# EAGLE design S88_Nano_16R0C_2Layers_DuPont (EAGLE 9.6.2)
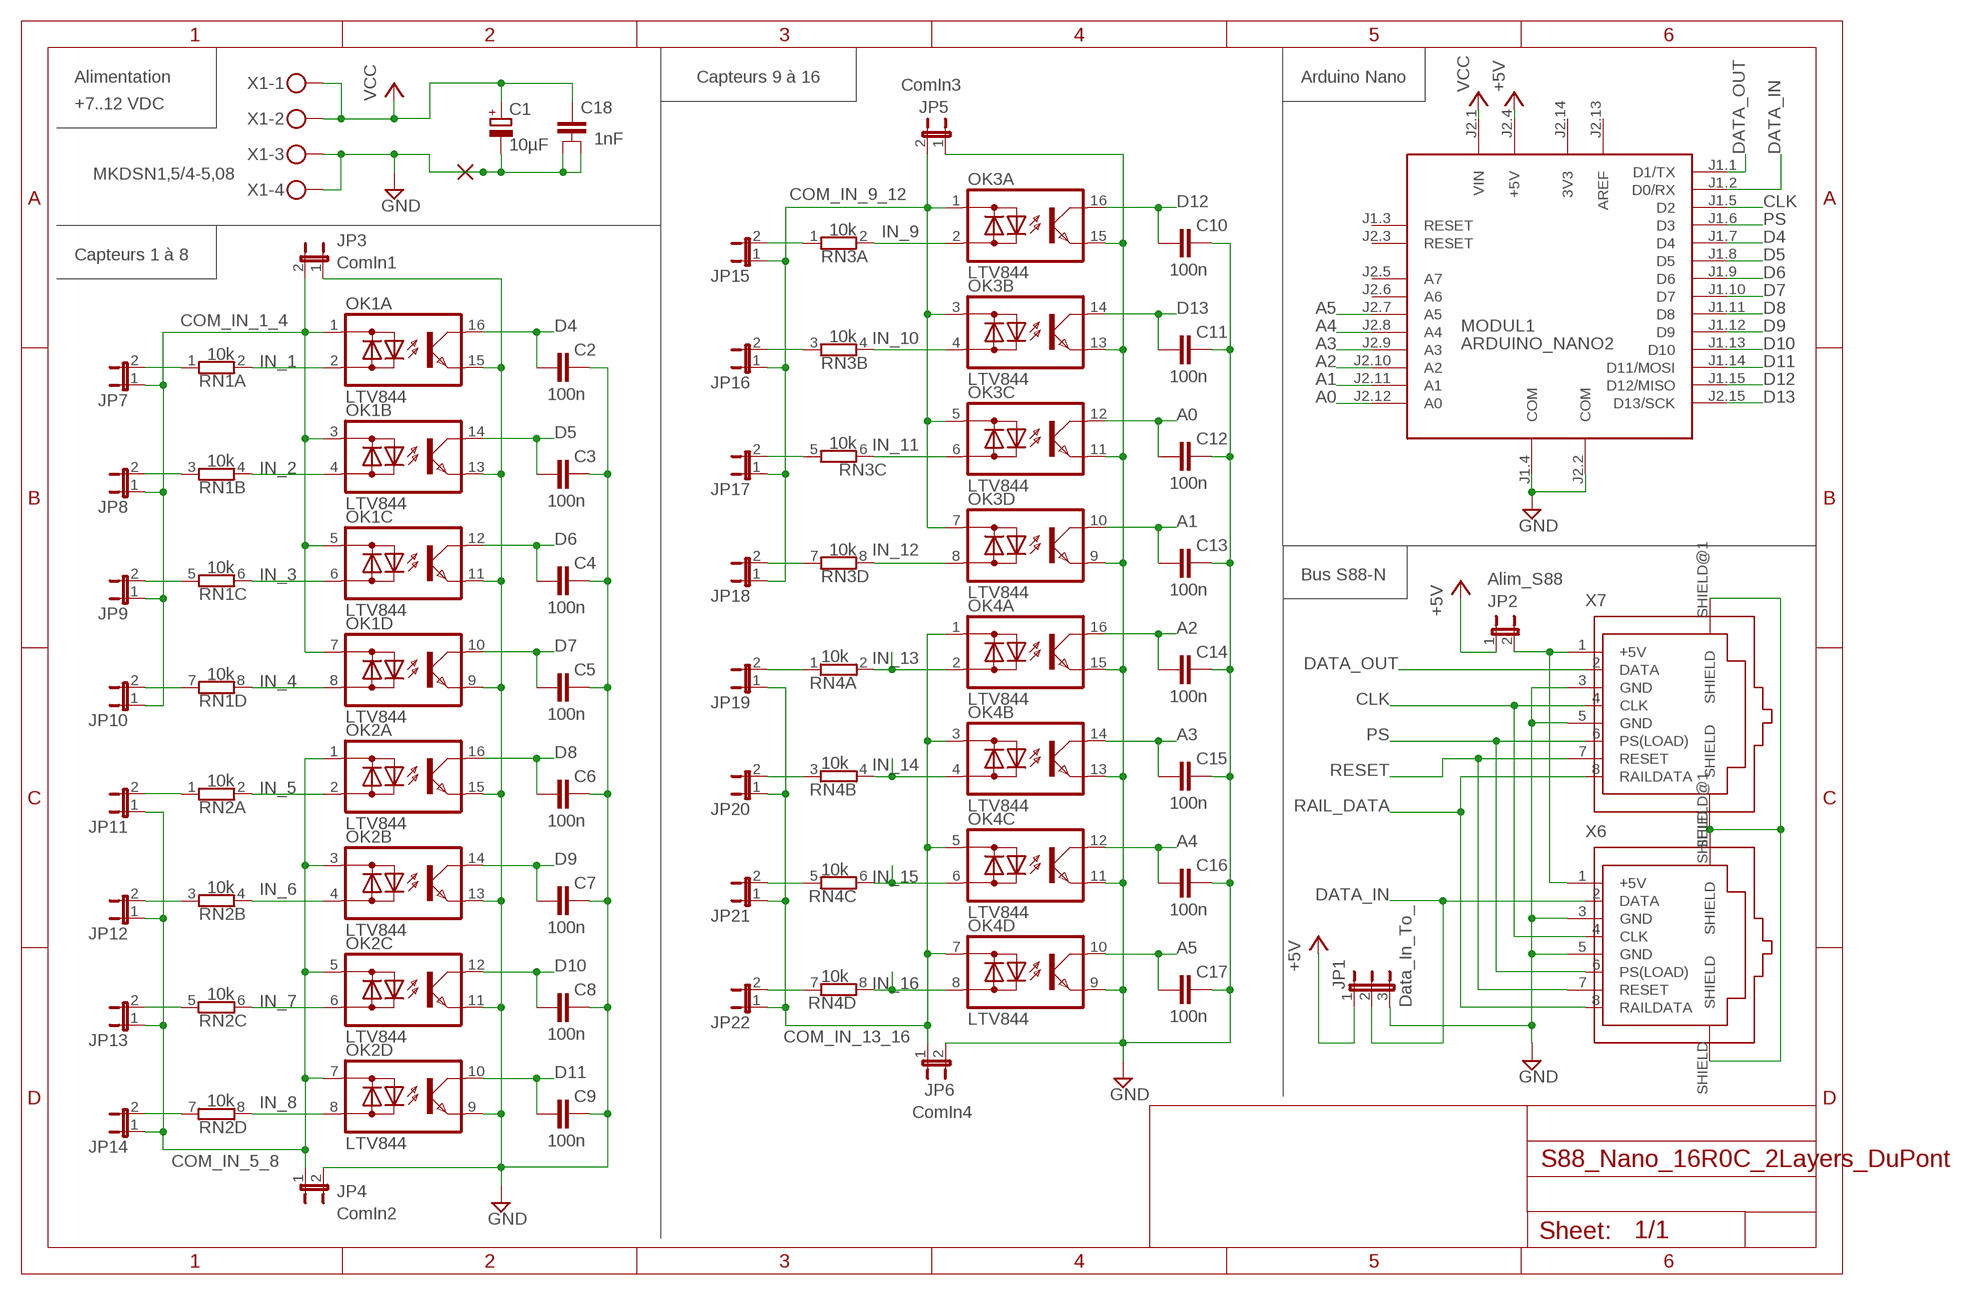
[diagram p0: schematic, sheet 1]

## Parts
C1  10µF  CPOL-EUE5-6  [E5-6]
C2  100n  C-EU025-025X050  [C025-025X050]
C3  100n  C-EU025-025X050  [C025-025X050]
C4  100n  C-EU025-025X050  [C025-025X050]
C5  100n  C-EU025-025X050  [C025-025X050]
C6  100n  C-EU025-025X050  [C025-025X050]
C7  100n  C-EU025-025X050  [C025-025X050]
C8  100n  C-EU025-025X050  [C025-025X050]
C9  100n  C-EU025-025X050  [C025-025X050]
C10  100n  C-EU025-025X050  [C025-025X050]
C11  100n  C-EU025-025X050  [C025-025X050]
C12  100n  C-EU025-025X050  [C025-025X050]
C13  100n  C-EU025-025X050  [C025-025X050]
C14  100n  C-EU025-025X050  [C025-025X050]
C15  100n  C-EU025-025X050  [C025-025X050]
C16  100n  C-EU025-025X050  [C025-025X050]
C17  100n  C-EU025-025X050  [C025-025X050]
C18  1nF  C-EU  [C025_050-024X070]
JP1  Data_In_To_  JP2E  [JP2]
JP2  Alim_S88  JP1E  [JP1]
JP3  ComIn1  JP1E  [JP1]
JP4  ComIn2  JP1E  [JP1]
JP5  ComIn3  JP1E  [JP1]
JP6  ComIn4  JP1E  [JP1]
JP7  JP1E  [JP1]
JP8  JP1E  [JP1]
JP9  JP1E  [JP1]
JP10  JP1E  [JP1]
JP11  JP1E  [JP1]
JP12  JP1E  [JP1]
JP13  JP1E  [JP1]
JP14  JP1E  [JP1]
JP15  JP1E  [JP1]
JP16  JP1E  [JP1]
JP17  JP1E  [JP1]
JP18  JP1E  [JP1]
JP19  JP1E  [JP1]
JP20  JP1E  [JP1]
JP21  JP1E  [JP1]
JP22  JP1E  [JP1]
MODUL1  ARDUINO_NANO2  [ARDUINO_NANO2]
OK1  LTV844  [DIL16]
OK2  LTV844  [DIL16]
OK3  LTV844  [DIL16]
OK4  LTV844  [DIL16]
PAD1  1,9/0,8  [1,6/0,9]
RN1  10k  E4R  [SIL8]
RN2  10k  E4R  [SIL8]
RN3  10k  E4R  [SIL8]
RN4  10k  E4R  [SIL8]
X1  MKDSN1,5/4-5,08  [MKDSN1,5/4-5,08]
X6  RJ45-SHIELDED  [RJ45-SHIELDED]
X7  RJ45-SHIELDED  [RJ45-SHIELDED]

## Nets
+5/S88: JP2.2 X6.1(+5V) X7.1(+5V)
+5V: JP1.1 JP2.1 MODUL1.J2.4(+5V)
A0: C12.1 MODUL1.J2.12(A0) OK3.12(C:C)
A1: C13.1 MODUL1.J2.11(A1) OK3.10(D:C)
A2: C14.1 MODUL1.J2.10(A2) OK4.16(A:C)
A3: C15.1 MODUL1.J2.9(A3) OK4.14(B:C)
A4: C16.1 MODUL1.J2.8(A4) OK4.12(C:C)
A5: C17.1 MODUL1.J2.7(A5) OK4.10(D:C)
CLK: MODUL1.J1.5(D2) X6.4(CLK) X7.4(CLK)
COM_IN_1_4: JP3.2 JP7.1 JP8.1 JP9.1 JP10.1 OK1.1(A:AC1) OK1.3(B:AC1) OK1.5(C:AC1) OK1.7(D:AC1)
COM_IN_5_8: JP4.1 JP11.1 JP12.1 JP13.1 JP14.1 OK2.1(A:AC1) OK2.3(B:AC1) OK2.5(C:AC1) OK2.7(D:AC1)
COM_IN_9_12: JP5.2 JP15.1 JP16.1 JP17.1 JP18.1 OK3.1(A:AC1) OK3.3(B:AC1) OK3.5(C:AC1) OK3.7(D:AC1)
COM_IN_13_16: JP6.1 JP19.1 JP20.1 JP21.1 JP22.1 OK4.1(A:AC1) OK4.3(B:AC1) OK4.5(C:AC1) OK4.7(D:AC1)
D4: C2.1 MODUL1.J1.7(D4) OK1.16(A:C)
D5: C3.1 MODUL1.J1.8(D5) OK1.14(B:C)
D6: C4.1 MODUL1.J1.9(D6) OK1.12(C:C)
D7: C5.1 MODUL1.J1.10(D7) OK1.10(D:C)
D8: C6.1 MODUL1.J1.11(D8) OK2.16(A:C)
D9: C7.1 MODUL1.J1.12(D9) OK2.14(B:C)
D10: C8.1 MODUL1.J1.13(D10) OK2.12(C:C)
D11: C9.1 MODUL1.J1.14(D11/MOSI) OK2.10(D:C)
D12: C10.1 MODUL1.J1.15(D12/MISO) OK3.16(A:C)
D13: C11.1 MODUL1.J2.15(D13/SCK) OK3.14(B:C)
DATA_IN: JP1.2 MODUL1.J1.2(D0/RX) X6.2(DATA)
DATA_OUT: MODUL1.J1.1(D1/TX) X7.2(DATA)
GND: C1.- C2.2 C3.2 C4.2 C5.2 C6.2 C7.2 C8.2 C9.2 C10.2 C11.2 C12.2 C13.2 C14.2 C15.2 C16.2 C17.2 C18.2 C18.3 JP1.3 JP3.1 JP4.2 JP5.1 JP6.2 MODUL1.J1.4(COM) MODUL1.J2.2(COM) OK1.9(D:E) OK1.11(C:E) OK1.13(B:E) OK1.15(A:E) OK2.9(D:E) OK2.11(C:E) OK2.13(B:E) OK2.15(A:E) OK3.9(D:E) OK3.11(C:E) OK3.13(B:E) OK3.15(A:E) OK4.9(D:E) OK4.11(C:E) OK4.13(B:E) OK4.15(A:E) PAD1.1(P) X1.3 X1.4 X6.3(GND) X6.5(GND) X7.3(GND) X7.5(GND)
IN_1: OK1.2(A:AC2) RN1.2
IN_2: OK1.4(B:AC2) RN1.4
IN_3: OK1.6(C:AC2) RN1.6
IN_4: OK1.8(D:AC2) RN1.8
IN_5: OK2.2(A:AC2) RN2.2
IN_6: OK2.4(B:AC2) RN2.4
IN_7: OK2.6(C:AC2) RN2.6
IN_8: OK2.8(D:AC2) RN2.8
IN_9: OK3.2(A:AC2) RN3.2
IN_10: OK3.4(B:AC2) RN3.4
IN_11: OK3.6(C:AC2) RN3.6
IN_12: OK3.8(D:AC2) RN3.8
IN_13: OK4.2(A:AC2) RN4.2
IN_14: OK4.4(B:AC2) RN4.4
IN_15: OK4.6(C:AC2) RN4.6
IN_16: OK4.8(D:AC2) RN4.8
N$1: JP7.2 RN1.1
N$2: JP8.2 RN1.3
N$3: JP9.2 RN1.5
N$4: JP10.2 RN1.7
N$5: JP11.2 RN2.1
N$6: JP19.2 RN4.1
N$7: JP14.2 RN2.7
N$8: JP13.2 RN2.5
N$9: JP18.2 RN3.7
N$10: JP20.2 RN4.3
N$11: JP12.2 RN2.3
N$12: JP21.2 RN4.5
N$13: JP22.2 RN4.7
N$14: JP15.2 RN3.1
N$15: JP16.2 RN3.3
N$16: JP17.2 RN3.5
PS: MODUL1.J1.6(D3) X6.6(PS(LOAD)) X7.6(PS(LOAD))
RAIL_DATA: X6.8(RAILDATA) X7.8(RAILDATA)
RESET: X6.7(RESET) X7.7(RESET)
SHIELD: X6.SHIELD X6.SHIELD@1(SHIELD) X7.SHIELD X7.SHIELD@1(SHIELD)
VCC: C1.+ C18.1 MODUL1.J2.1(VIN) X1.1 X1.2
Unconnected: MODUL1.J1.3(RESET) MODUL1.J2.3(RESET) MODUL1.J2.5(A7) MODUL1.J2.6(A6)

## Notes on the sheet
- Alimentation | Capteurs 9 à 16 | Arduino Nano
- +7..12 VDC
- Capteurs 1 à 8
- Bus S88-N

## Power pins joined to a net without a drawn wire
3V3: MODUL1.J2.14(3V3)
AREF: MODUL1.J2.13(AREF)

## Library data of the parts
C1 = rcl:CPOL-EU: POLARIZED CAPACITOR, European symbol
C2-C17 = rcl:C-EU: CAPACITOR, European symbol
C18 = rcl_perso:C-EU: CAPACITOR grid 2.54 mm + 5.08 mm, outline 2.4 x 7 mm
JP1 = jumper:JP2E: JUMPER
JP2-JP22 = jumper:JP1E: JUMPER
MODUL1 = arduino_Nano:ARDUINO_NANO2: Arduino Nano2 Auto generated by modulcreator.ulp \;; ANZAHL: 2; MODUL: TRUE; STECKX0: -76200; STECKX1: 76200; STECKY0: 177800; STECKY1: 177800
OK1-OK4 = optocoupler:LTV844: LITEON OPTO COUPLER
PAD1 = wirepad:1,9/0,8: THROUGH-HOLE PAD
RN1-RN4 = resistor-sil:E4R: SIL RESISTOR
X1 = con-phoenix-508:MKDSN1,5/4-5,08: MKDSN 1,5/ 4-5,08 Printklemme Nennstrom: 13,5 A Nennspannung: 250 V Rastermaß: 5,08 mm Polzahl: 4 Anschlussart: Schraubanschluss Montage: Löten Anschlussrichtung Leiter/Platine: 0 ° Artikelnummer: 1729144 Source: http://eshop.phoenixcontact.com .. 1729144.pdf
X6 X7 = con-amphenol-rj45_S88-N:RJ45-SHIELDED: RJ45 socket Naming: BEL FUSE SS-7188S-A-NF TME SS-7188S-A-NF Datasheet: https://www.belfuse.com/resources/drawings/stewartconnector/dr-stw-ss-7188s-a-nf-ss-7188s-a-nf-50.pdf

## Board
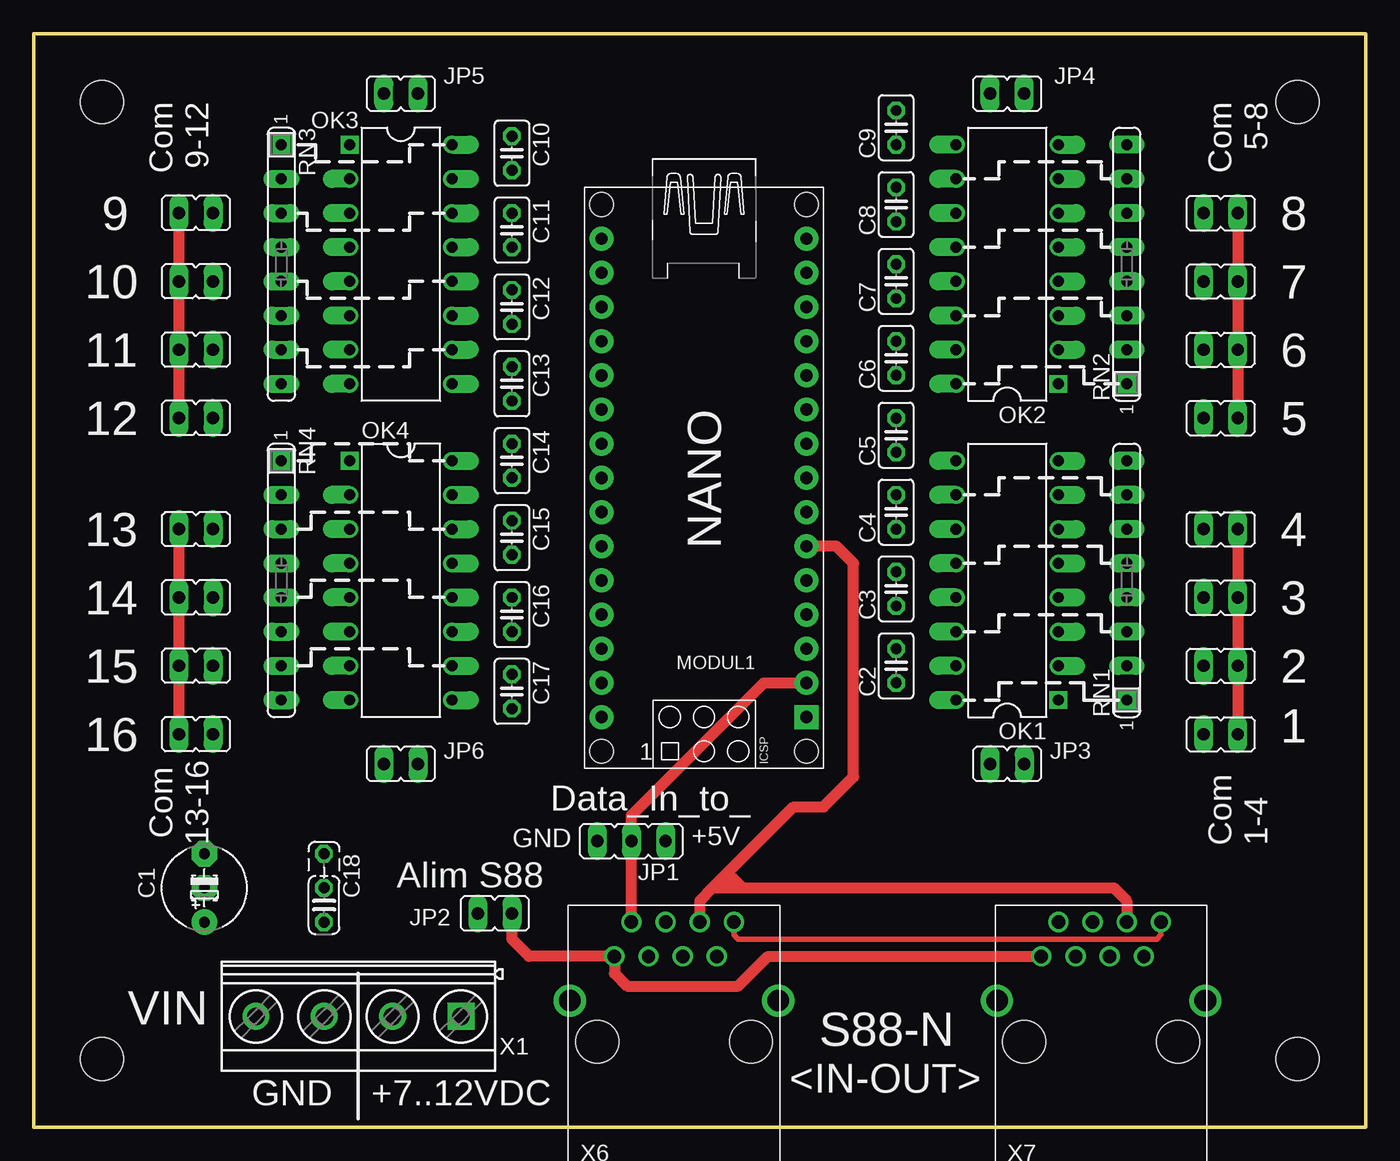
[diagram p1: board, top side]
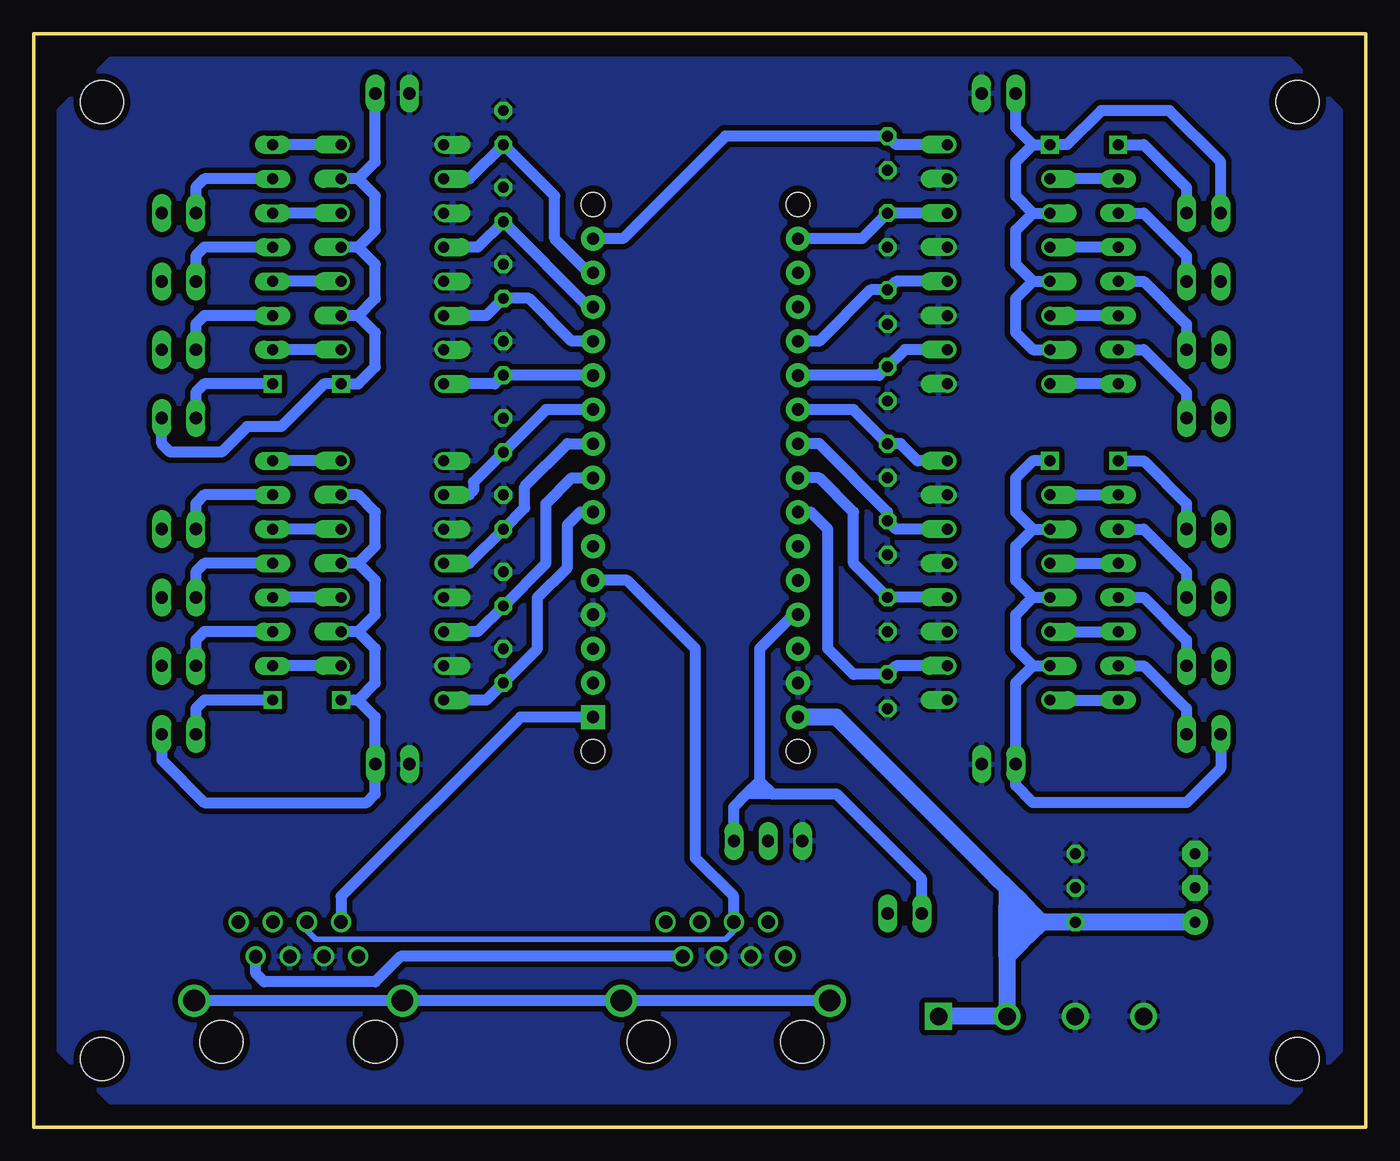
[diagram p2: board, bottom side, seen from below]

Size 99.06 x 81.28 mm. Coordinates in mm from the lower left corner, seen from the top.
Outline: 0,0 0,81.28 99.06,81.28 99.06,0 0,0
Copper layers (1*16): Top 0.035mm / dielectric 1.5mm / Bottom 0.035mm
Design rules "default *": minimum track width 10mil, minimum drill 24mil, track to track 8mil, track to pad 8mil, pad to pad 8mil, via to via 8mil, smd to smd 8mil, copper to edge 20mil, drill to drill 16mil, minimum pad ring 10mil, minimum via ring 8mil, stop-mask expansion 16mil, vias tented up to drill 0mil, thermal gap 10mil
Holes 3.2 mm at 93.98,5.08 5.08,5.08 5.08,76.2 93.98,76.2

### Footprints (pad centres in the part's own frame; a part is rotated, then mirrored left to right if it is on the bottom)
E5-6 = drill 0.813 pad 1.905: + -2.54,0 | drill 0.813 pad 1.905 octagon: - 2.54,0
C025-025X050 = drill 0.813 octagon: 1 -1.27,0; 2 1.27,0
C025_050-024X070 = drill 0.813 octagon: 1 2.54,0; 2 0,0; 3 -2.54,0
JP2 = drill 0.914 long: 1 -2.54,0; 2 0,0; 3 2.54,0
JP1 = drill 0.914 long: 1 0,-1.27; 2 0,1.27
ARDUINO_NANO2 = drill 0.914 pad 1.778 square: J1.1 -7.62,17.78 | drill 0.914 pad 1.778: J1.2 -7.62,15.24; J1.3 -7.62,12.7; J1.4 -7.62,10.16; J1.5 -7.62,7.62; J1.6 -7.62,5.08; J1.7 -7.62,2.54; J1.8 -7.62,0; J1.9 -7.62,-2.54; J1.10 -7.62,-5.08; J1.11 -7.62,-7.62; J1.12 -7.62,-10.16; J1.13 -7.62,-12.7; J1.14 -7.62,-15.24; J1.15 -7.62,-17.78; J2.1 7.62,17.78; J2.2 7.62,15.24; J2.3 7.62,12.7; J2.4 7.62,10.16; J2.5 7.62,7.62; J2.6 7.62,5.08; J2.7 7.62,2.54; J2.8 7.62,0; J2.9 7.62,-2.54; J2.10 7.62,-5.08; J2.11 7.62,-7.62; J2.12 7.62,-10.16; J2.13 7.62,-12.7; J2.14 7.62,-15.24; J2.15 7.62,-17.78 | hole 1.778: -7.62,-20.32; 7.62,-20.32; 7.62,20.32; -7.62,20.32
DIL16 = drill 0.813 square: 1 -8.89,-3.81 | drill 0.813 offset: 2 -6.35,-3.81; 3 -3.81,-3.81; 4 -1.27,-3.81; 5 1.27,-3.81; 6 3.81,-3.81; 7 6.35,-3.81; 8 8.89,-3.81; 9 8.89,3.81; 10 6.35,3.81; 11 3.81,3.81; 12 1.27,3.81; 13 -1.27,3.81; 14 -3.81,3.81; 15 -6.35,3.81; 16 -8.89,3.81
1,6/0,9 = drill 0.813 pad 1.905 octagon: 1 0,0
SIL8 = drill 0.813 square: 1 -8.89,0 | drill 0.813 long: 2 -6.35,0; 3 -3.81,0; 4 -1.27,0; 5 1.27,0; 6 3.81,0; 7 6.35,0; 8 8.89,0
MKDSN1,5/4-5,08 = drill 1.3 pad 2 square: 1 -7.641,0.025 | drill 1.3 pad 2: 2 -2.561,0.025; 3 2.519,0.025; 4 7.599,0.025
RJ45-SHIELDED = drill 1: 1 -5.08,7.62; 2 -3.81,10.16; 3 -2.54,7.62; 4 -1.27,10.16; 5 0,7.62; 6 1.27,10.16; 7 2.54,7.62; 8 3.81,10.16 | drill 1.6: SHIELD -8.382,4.318; SHIELD@1 7.112,4.318 | hole 3.2: -6.35,1.27; 5.08,1.27

### Placement (x,y rotation side)
C1  12.7,17.78 90 top
C2  64.14,34.29 90 top
C3  64.14,40.01 90 top
C4  64.14,45.72 90 top
C5  64.14,51.44 90 top
C6  64.14,57.15 90 top
C7  64.14,62.87 90 top
C8  64.14,68.58 90 top
C9  64.14,74.3 90 top
C10  35.56,72.39 270 top
C11  35.56,66.67 270 top
C12  35.56,60.96 270 top
C13  35.56,55.24 270 top
C14  35.56,49.53 270 top
C15  35.56,43.81 270 top
C16  35.56,38.1 270 top
C17  35.56,32.38 270 top
C18  21.59,17.78 270 top
JP1  44.45,21.27 180 top
JP2  34.29,15.88 270 top
JP3  72.39,26.99 270 top
JP4  72.39,76.83 90 top
JP5  27.3,76.83 90 top
JP6  27.3,26.99 270 top
JP7  88.27,29.21 90 top
JP8  88.27,34.29 90 top
JP9  88.27,39.37 90 top
JP10  88.27,44.45 90 top
JP11  88.27,52.7 90 top
JP12  88.27,57.78 90 top
JP13  88.27,62.87 90 top
JP14  88.27,67.94 90 top
JP15  12.06,67.94 270 top
JP16  12.06,62.87 270 top
JP17  12.06,57.78 270 top
JP18  12.06,52.7 270 top
JP19  12.06,44.45 270 top
JP20  12.06,39.37 270 top
JP21  12.06,34.29 270 top
JP22  12.06,29.21 270 top
MODUL1  49.85,48.26 180 top
OK1  72.39,40.64 90 top
OK2  72.39,64.14 90 top
OK3  27.3,64.14 270 top
OK4  27.3,40.64 270 top
PAD1  12.7,17.78 0 top
RN1  81.28,40.64 90 top
RN2  81.28,64.14 90 top
RN3  18.41,64.14 270 top
RN4  18.41,40.64 270 top
X1  24.13,8.26 180 top
X6  48.26,5.08 0 top
X7  80.01,5.08 0 top

### Tracks (layer width: path | path; a pad name or v marks a point on that pad's centre or on a via)
+5/S88
  Top 0.813: X7.1 54.61,12.7 52.39,10.48 44.13,10.48 43.18,11.43 X6.1 36.83,12.7 35.56,13.97 JP2.2
+5V
  Bottom 0.813: MODUL1.J2.4 42.55,38.1 45.09,35.56 45.09,25.72 | JP2.1 33.02,18.41 39.37,24.77 44.13,24.77 | 45.09,25.72 44.13,24.77 | 46.04,24.77 46.99,23.81 JP1.1 | 46.04,24.77 45.09,25.72 | 44.13,24.77 46.04,24.77
A0
  Bottom 0.813: MODUL1.J2.12 40.64,58.42 36.83,62.23 C12.1 34.92,62.87 OK3.12
A1
  Bottom 0.813: OK3.10 34.29,57.78 C13.1 36.2,55.88 MODUL1.J2.11
A2
  Bottom 0.813: MODUL1.J2.10 38.1,53.34 C14.1 34.61,50.8 33.34,49.53 OK4.16
A3
  Bottom 0.813: OK4.14 34.92,44.45 C15.1 35.56,45.72 40.64,50.8 MODUL1.J2.9
A4
  Bottom 0.813: OK4.12 C16.1 38.1,41.91 38.1,45.72 40.64,48.26 MODUL1.J2.8
A5
  Bottom 0.813: OK4.10 34.92,34.29 C17.1 38.1,33.66 40.01,35.56 40.01,44.45 41.27,45.72 MODUL1.J2.7
CLK
  Bottom 0.406: X7.4 78.74,14.61 78.11,13.97 47.62,13.97 46.99,14.61 X6.4
  Bottom 0.813: MODUL1.J1.5 54.93,40.64 49.85,35.56 49.85,20 46.99,17.14 X6.4
COM_IN_1_4
  Top 0.813: JP10.1 JP9.1 JP8.1 JP7.1
  Bottom 0.813: OK1.7 74.93,46.99 73.66,45.72 73.66,43.18 74.93,41.91 | 74.93,41.91 OK1.5 | 74.93,41.91 73.66,40.64 73.66,38.1 74.93,36.83 | 74.93,36.83 OK1.3 | 74.93,36.83 73.66,35.56 73.66,33.02 74.93,31.75 | 74.93,31.75 OK1.1 | 74.93,31.75 73.66,30.48 JP3.2 73.66,24.77 74.3,24.13 86.36,24.13 89.53,27.3 JP7.1
COM_IN_5_8
  Top 0.813: JP14.1 JP13.1 JP12.1 JP11.1
  Bottom 0.813: 74.93,60.33 73.66,59.05 73.66,56.52 74.93,55.24 OK2.1 77.47,55.24 80.64,52.07 83.19,52.07 85.09,50.16 88.9,50.16 89.53,50.8 JP11.1 | 74.93,60.33 OK2.3 | 74.93,60.33 73.66,61.59 73.66,64.14 74.93,65.41 | 74.93,65.41 OK2.5 | 74.93,65.41 73.66,66.67 73.66,69.22 74.93,70.48 | 74.93,70.48 OK2.7 | 74.93,70.48 73.66,71.75 JP4.1
COM_IN_9_12
  Top 0.813: JP15.1 JP16.1 JP17.1 JP18.1
  Bottom 0.813: 24.77,73.03 26.04,71.75 26.04,69.22 24.77,67.94 | 24.77,67.94 OK3.3 | 24.77,67.94 26.04,66.67 26.04,64.14 24.77,62.87 | 24.77,62.87 OK3.5 | 24.77,62.87 26.04,61.59 26.04,59.05 24.77,57.78 OK3.7 | 24.77,73.03 OK3.1 22.23,73.03 19.68,75.56 14.61,75.56 10.79,71.75 JP15.1 | 24.77,73.03 26.04,74.3 JP5.2
COM_IN_13_16
  Top 0.813: JP19.1 JP20.1 JP21.1 JP22.1
  Bottom 0.813: 24.77,44.45 26.04,45.72 26.04,48.26 24.77,49.53 OK4.1 | 24.77,44.45 OK4.3 | 24.77,44.45 26.04,43.18 26.04,40.64 24.77,39.37 | 24.77,39.37 OK4.5 | 24.77,39.37 26.04,38.1 26.04,35.56 24.77,34.29 | 24.77,34.29 OK4.7 | 24.77,34.29 26.04,33.02 JP6.1 26.04,25.4 24.77,24.13 13.34,24.13 10.79,26.67 JP22.1
D4
  Bottom 0.813: OK1.16 65.41,31.75 C2.1 61.59,35.56 61.59,39.37 59.37,41.59 59.37,44.77 58.42,45.72 MODUL1.J1.7
D5
  Bottom 0.813: OK1.14 66.04,36.83 C3.1 60.96,41.91 60.96,46.35 59.05,48.26 MODUL1.J1.8
D6
  Bottom 0.813: OK1.12 66.67,41.91 C4.1 62.55,46.04 62.55,47.62 59.37,50.8 MODUL1.J1.9
D7
  Bottom 0.813: OK1.10 66.67,46.99 66.36,47.31 66.36,47.94 C5.1 60.96,53.34 MODUL1.J1.10
D8
  Bottom 0.813: MODUL1.J1.11 C6.1 64.77,55.24 OK2.16
D9
  Bottom 0.813: MODUL1.J1.12 59.05,58.42 62.23,61.59 C7.1 65.41,60.33 OK2.14
D10
  Bottom 0.813: MODUL1.J1.13 57.78,60.96 C8.1 66.04,65.41 OK2.12
D11
  Bottom 0.813: MODUL1.J1.14 57.78,63.5 60.33,66.04 60.33,69.22 C9.1 66.67,70.48 OK2.10
D12
  Bottom 0.813: OK3.16 34.92,73.03 C10.1 47.62,73.66 55.24,66.04 MODUL1.J1.15
D13
  Bottom 0.813: OK3.14 C11.1 37.47,66.04 MODUL1.J2.15
DATA_IN
  Top 0.813: MODUL1.J1.2 54.29,33.02 44.45,23.18 JP1.2 X6.2
DATA_OUT
  Bottom 0.813: MODUL1.J1.1 62.87,30.48 76.2,17.14 X7.2
GND
  pour Bottom (isolate 0.406): 93.34,1.91 5.71,1.91 1.91,5.71 1.91,75.56 5.71,79.38 93.34,79.38 97.16,75.56 97.16,5.71
IN_1
  Bottom 0.813: OK1.2 RN1.2
IN_2
  Bottom 0.813: OK1.4 RN1.4
IN_3
  Bottom 0.813: OK1.6 RN1.6
IN_4
  Bottom 0.813: OK1.8 RN1.8
IN_5
  Bottom 0.813: OK2.2 RN2.2
IN_6
  Bottom 0.813: OK2.4 RN2.4
IN_7
  Bottom 0.813: OK2.6 RN2.6
IN_8
  Bottom 0.813: OK2.8 RN2.8
IN_9
  Bottom 0.813: RN3.2 OK3.2
IN_10
  Bottom 0.813: RN3.4 OK3.4
IN_11
  Bottom 0.813: RN3.6 OK3.6
IN_12
  Bottom 0.813: RN3.8 OK3.8
IN_13
  Bottom 0.813: OK4.2 RN4.2
IN_14
  Bottom 0.813: OK4.4 RN4.4
IN_15
  Bottom 0.813: OK4.6 RN4.6
IN_16
  Bottom 0.813: OK4.8 RN4.8
N$1
  Bottom 0.813: RN1.1 86.36,31.75 87,31.11 JP7.2
N$2
  Bottom 0.813: RN1.3 86.36,36.83 87,36.2 JP8.2
N$3
  Bottom 0.813: RN1.5 86.36,41.91 87,41.27 JP9.2
N$4
  Bottom 0.813: RN1.7 86.36,46.99 87,46.35 JP10.2
N$5
  Bottom 0.813: RN2.1 86.36,55.24 87,54.61 JP11.2
N$6
  Bottom 0.813: RN4.1 16.51,49.53 13.34,46.35 JP19.2
N$7
  Bottom 0.813: RN2.7 86.36,70.48 87,69.85 JP14.2
N$8
  Bottom 0.813: RN2.5 86.36,65.41 87,64.77 JP13.2
N$9
  Bottom 0.813: JP18.2 13.34,54.61 16.51,57.78 RN3.7
N$10
  Bottom 0.813: RN4.3 16.51,44.45 13.34,41.27 JP20.2
N$11
  Bottom 0.813: RN2.3 86.36,60.33 87,59.69 JP12.2
N$12
  Bottom 0.813: RN4.5 16.51,39.37 13.34,36.2 JP21.2
N$13
  Bottom 0.813: RN4.7 16.51,34.29 13.34,31.11 JP22.2
N$14
  Bottom 0.813: JP15.2 13.34,69.85 16.51,73.03 RN3.1
N$15
  Bottom 0.813: JP16.2 13.34,64.77 16.51,67.94 RN3.3
N$16
  Bottom 0.813: JP17.2 13.34,59.69 16.51,62.87 RN3.5
PS
  Top 0.813: MODUL1.J1.6 59.69,43.18 60.96,41.91 60.96,26.04 58.74,23.81 56.52,23.81 51.59,18.89 | 50.48,17.78 52.07,17.78 | 52.7,17.78 80.33,17.78 81.28,16.83 X7.6 | X6.6 49.53,16.83 50.48,17.78 | 51.59,18.89 51.28,18.57 | 51.28,18.57 50.48,17.78 | 52.07,17.78 52.7,17.78 | 52.07,17.78 51.28,18.57 | 52.7,17.78 51.59,18.89
RAIL_DATA
  Top 0.406: X6.8 52.07,14.29 52.39,13.97 83.5,13.97 83.82,14.29 X7.8
RESET
  Bottom 0.813: X6.7 71.75,12.7 73.66,10.79 81.92,10.79 82.55,11.43 X7.7
SHIELD
  Bottom 0.813: X6.SHIELD X6.SHIELD@1 X7.SHIELD X7.SHIELD@1
VCC
  Bottom 1.27: X1.1 X1.2 26.69,12.68 | MODUL1.J2.1 39.37,30.48 27.62,18.73 26.67,17.78 | 24.13,15.24 25.08,16.19 | 25.08,16.19 26.04,17.14 | 24.13,15.24 25.08,14.29 | 25.08,14.29 26.04,13.34 | 26.04,13.34 26.69,12.68 | 24.13,15.24 C18.1 C1.+ | 25.08,14.29 25.08,16.19 | 26.04,13.34 26.04,17.14 | 26.04,17.14 26.67,17.78 | 26.69,12.68 26.69,16.49 26.67,16.51 26.67,17.78

### Text on the board
tNames: Com / 9-12 | Com / 5-8 | 9 | 8 | 10 | 7 | 11 | 6 | 12 | 5 | 13 | 4 | 14 | 3 | 15 | 2 | 1 | 16 | Com / 13-16 | Data_In_to_ | GND | +5V | Com / 1-4 | Alim S88 | VIN | S88-N | <IN-OUT> | GND | +7..12VDC